# EAGLE design HomeAutomationModuleV2 (EAGLE 8.2.2)
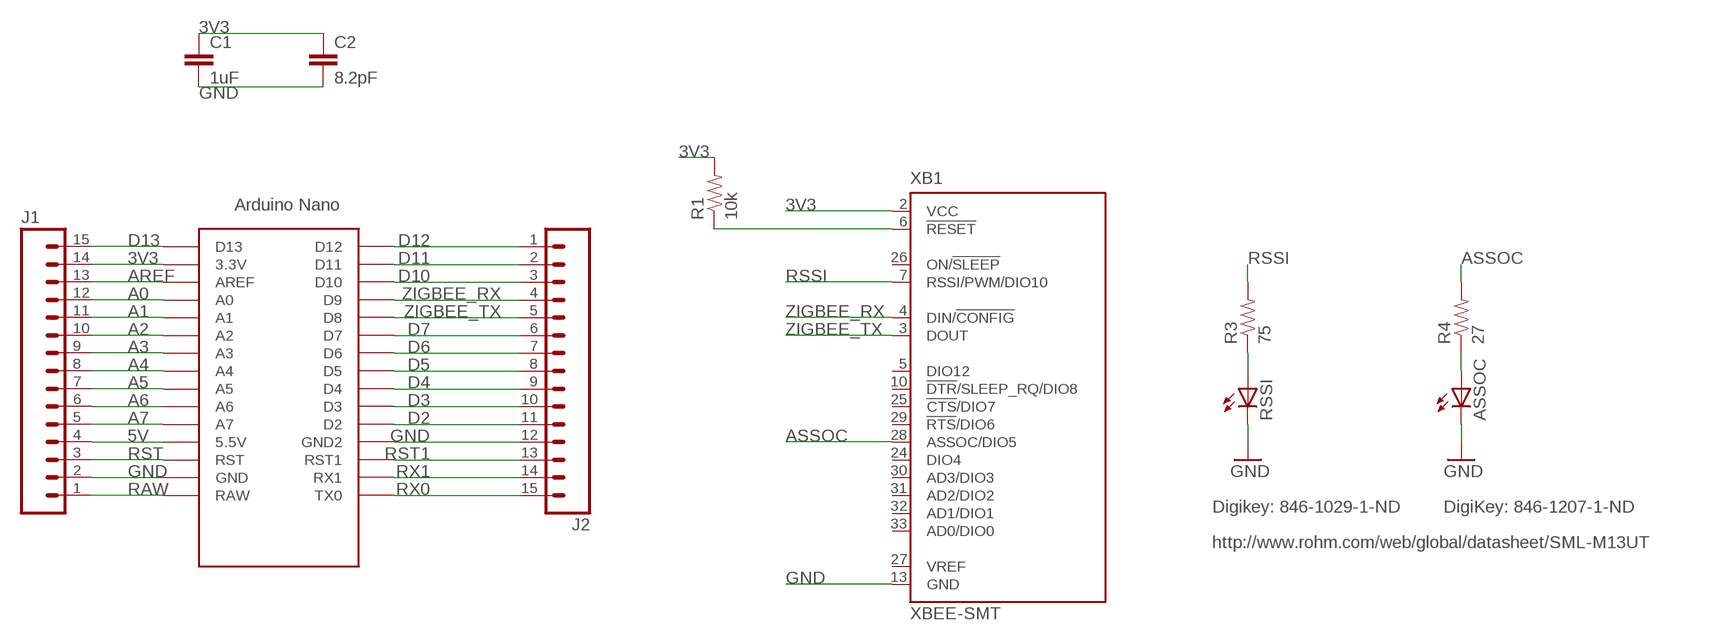
[diagram p0: schematic, sheet 1]

## Parts
ASSOC  LEDCHIP-LED0805  [CHIP-LED0805]
C1  1uF  0.33UF-50V-10%(0805)  [0805-CAP]
C2  8.2pF  0.33UF-50V-10%(0805)  [0805-CAP]
J1  M15  [1X15]
J2  M15  [1X15]
R1  10k  0.3OHM-1/8W-1%(0805)  [0805]
R3  75  RESISTOR0805-RES  [0805]
R4  27  RESISTOR0805-RES  [0805]
RSSI  LEDCHIP-LED0805  [CHIP-LED0805]
U$1  NANO  [NANO]
XB1  XBEE-SMT  [XBEE-SMT]

## Nets
3V3: C1.1 C2.1 J1.14 R1.2 U$1.3.3V XB1.2(VCC)
5V: J1.4 U$1.5V(5.5V)
A0: J1.12 U$1.A0
A1: J1.11 U$1.A1
A2: J1.10 U$1.A2
A3: J1.9 U$1.A3
A4: J1.8 U$1.A4
A5: J1.7 U$1.A5
A6: J1.6 U$1.A6
A7: J1.5 U$1.A7
AREF: J1.13 U$1.AREF
ASSOC: R4.2 XB1.28(ASSOC/DIO5)
D2: J2.11 U$1.D2
D3: J2.10 U$1.D3
D4: J2.9 U$1.D4
D5: J2.8 U$1.D5
D6: J2.7 U$1.D6
D7: J2.6 U$1.D7
D10: J2.3 U$1.D10
D11: J2.2 U$1.D11
D12: J2.1 U$1.D12
D13: J1.15 U$1.D13
GND: ASSOC.C C1.2 C2.2 J1.2 J2.12 RSSI.C U$1.GND U$1.GND1(GND2) XB1.13(GND)
N$1: ASSOC.A R4.1
N$2: R1.1 XB1.6(!RESET)
N$8: R3.1 RSSI.A
RAW: J1.1 U$1.RAW
RSSI: R3.2 XB1.7(RSSI/PWM/DIO10)
RST: J1.3 U$1.RST
RST1: J2.13 U$1.RST1
RX0: J2.15 U$1.TX0
RX1: J2.14 U$1.RX1
ZIGBEE_RX: J2.4 U$1.D9 XB1.4(DIN/!CONFIG)
ZIGBEE_TX: J2.5 U$1.D8 XB1.3(DOUT)
Unconnected: U$1.ICSP1 U$1.ICSP2 U$1.ICSP3 U$1.ICSP4 U$1.ICSP5 U$1.ICSP6 XB1.5(DIO12) XB1.10(!DTR!/SLEEP_RQ/DIO8) XB1.24(DIO4) XB1.25(!CTS!/DIO7) XB1.26(ON/!SLEEP) XB1.27(VREF) XB1.29(!RTS!/DIO6) XB1.30(AD3/DIO3) XB1.31(AD2/DIO2) XB1.32(AD1/DIO1) XB1.33(AD0/DIO0)

## Notes on the sheet
- Digikey: 846-1029-1-ND | DigiKey: 846-1207-1-ND
- http://www.rohm.com/web/global/datasheet/SML-M13UT

## Library data of the parts
ASSOC RSSI = adafruit:LED: LED OSRAM: - CHIPLED LG R971, LG N971, LY N971, LG Q971, LY Q971, LO R971, LY R971 LH N974, LH R974 LS Q976, LO Q976, LY Q976 LO Q996 - Hyper CHIPLED LW Q18S LB Q993, LB Q99A, LB R99A - SideLED LS A670, LO A670, LY A670, LG A670, LP A670 LB A673, LV A673, LT A673, LW A673 LH A674 LY A675 LS A676, LA A676, LO A676, LY A676, LW A676 LS A679, LY A679, LG A679 - Hyper Micro SIDELED® LS Y876, LA Y876, LO Y876, LY Y876 LT Y87S - SmartLED LW L88C, LW L88S LB L89C, LB L89S, LG L890 LS L89K, LO L89K, LY L89K LS L896, LA L896, LO L896, LY L896 - TOPLED LS T670, LO T670, LY T670, LG T670, LP T670 LSG T670, LSP T670, LSY T670, LOP T670, LYG T670 LG T671, LOG T671, LSG T671 LB T673, LV T673, LT T673, LW T673 LH T674 LS T676, LA T676, LO T676, LY T676, LB T676, LH T676, LSB T676, LW T676 LB T67C, LV T67C, LT T67C, LS T67K, LO T67K, LY T67K, LW E67C LS E67B, LA E67B, LO E67B, LY E67B, LB E67C, LV E67C, LT E67C LW T67C LS T679, LY T679, LG T679 LS T770, LO T770, LY T770, LG T770, LP T770 LB T773, LV T773, LT T773, LW T773 LH T774 LS E675, LA E675, LY E675, LS T675 LS T776, LA T776, LO T776, LY T776, LB T776 LHGB T686 LT T68C, LB T68C - Hyper Mini TOPLED® LB M676 - Mini TOPLED Santana® LG M470 LS M47K, LO M47K, LY M47K Source: http://www.osram.convergy.de/
C1 C2 = SparkFun-Capacitors:0.33UF-50V-10%(0805): CAP-08469; PROD_ID: CAP-08469; VALUE: 0.33uF
J1 J2 = SparkFun-Connectors:M15: Header 15 Standard 15-pin 0.1" header. Use with straight break away headers (SKU : PRT-00116), right angle break away headers (PRT-00553), swiss pins (PRT-00743), machine pins (PRT-00117), and female headers (PRT-00115).
R1 = SparkFun-Resistors:0.3OHM-1/8W-1%(0805): RES-11622; PROD_ID: RES-11622; VALUE: 0.3
R3 R4 = SparkFun-Passives:RESISTOR: Resistor Basic schematic elements and footprints for 0603, 1206, and PTH resistors.
U$1 = Arduino-clone:NANO: Arduino Nano
XB1 = xbee:XBEE-SMT: XBee(TM)/XBee-PRO(TM) ZB SMT RF Modules. Source: Digi (90002002_a.pdf) (http://www.digi.com/products/wireless-wired-embedded-solutions/zigbee-rf-modules/zigbee-mesh-module/xbee-smt.jsp#overview)

## Board
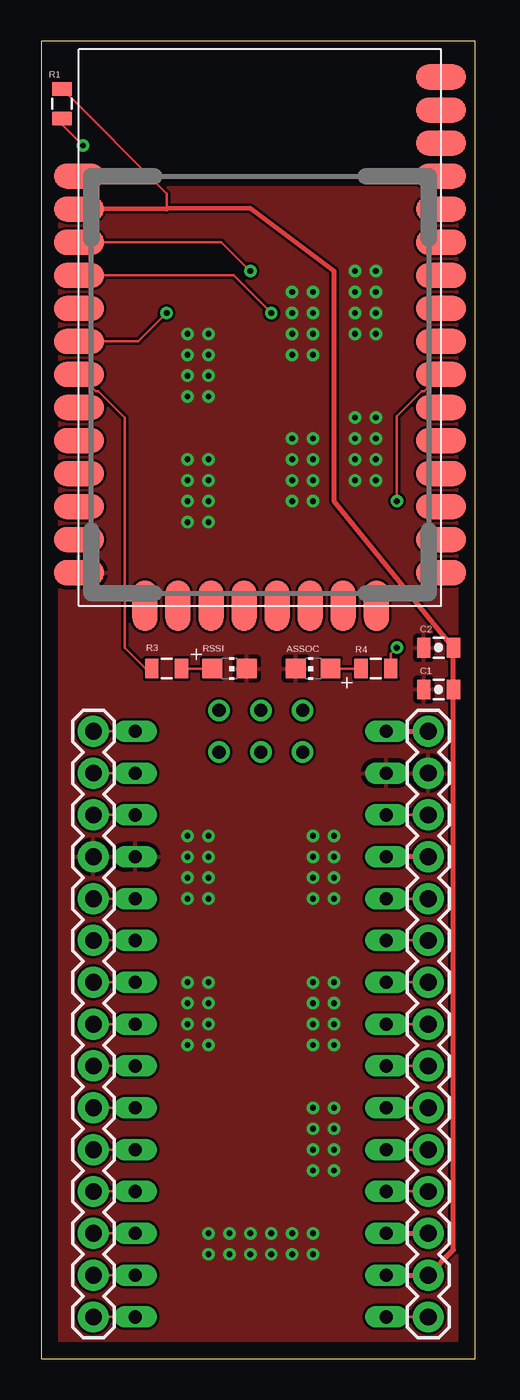
[diagram p1: board, top side]
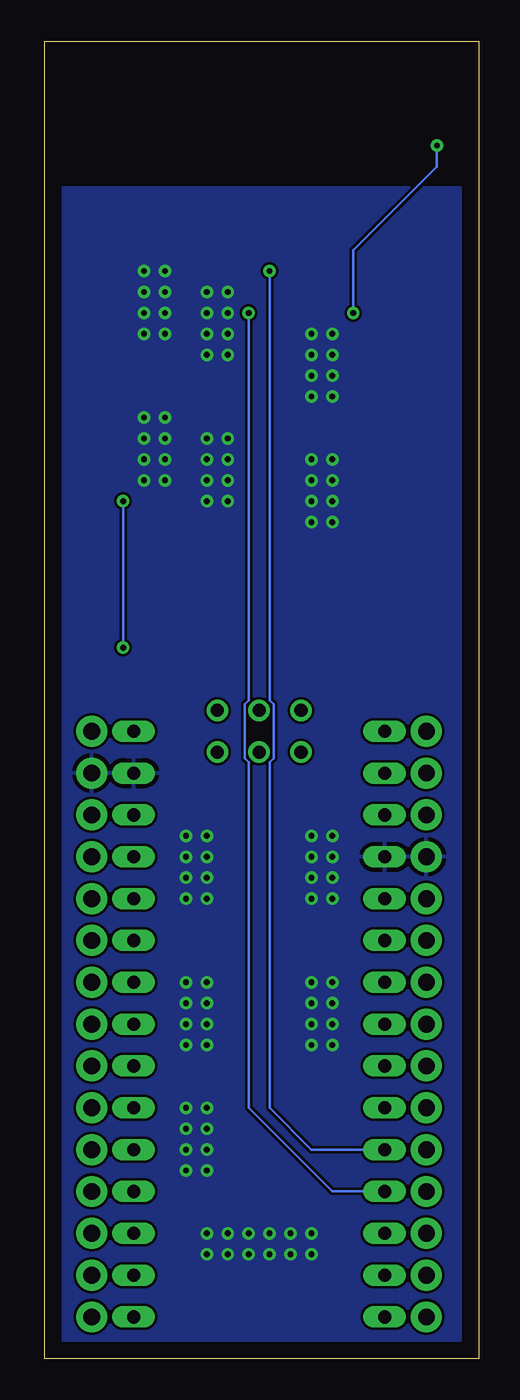
[diagram p2: board, bottom side, seen from below]

Size 26.34 x 80 mm. Coordinates in mm from the lower left corner, seen from the top.
Outline: 0,0 26.34,0 26.34,80 0,80 0,0
Copper layers (1*16): Top 0.035mm / dielectric 1.5mm / Bottom 0.035mm
Design rules "default": minimum track width 6mil, minimum drill 0.35mm, track to track 6mil, track to pad 6mil, pad to pad 6mil, via to via 6mil, smd to smd 6mil, copper to edge 40mil, drill to drill 6mil, minimum pad ring 10mil, minimum via ring 8mil, stop-mask expansion 4mil, vias tented up to drill 0mil, thermal gap 10mil

### Footprints (pad centres in the part's own frame; a part is rotated, then mirrored left to right if it is on the bottom)
CHIP-LED0805 = smd 1.2 x 1.2: A 0,-1.05; C 0,1.05
0805-CAP = smd 0.8 x 1.2: 1 -0.9,0; 2 0.9,0
1X15 = drill 1.016 pad 1.88: 1 0,0; 2 2.54,0; 3 5.08,0; 4 7.62,0; 5 10.16,0; 6 12.7,0; 7 15.24,0; 8 17.78,0; 9 20.32,0; 10 22.86,0; 11 25.4,0; 12 27.94,0; 13 30.48,0; 14 33.02,0; 15 35.56,0
0805 = smd 0.8 x 1.2: 1 -0.9,0; 2 0.9,0
NANO = drill 0.8 long: 3.3V -10.16,24.13; 5V -10.16,-1.27; A0 -10.16,19.05; A1 -10.16,16.51; A2 -10.16,13.97; A3 -10.16,11.43; A4 -10.16,8.89; A5 -10.16,6.35; A6 -10.16,3.81; A7 -10.16,1.27; AREF -10.16,21.59; D2 5.08,1.27; D3 5.08,3.81; D4 5.08,6.35; D5 5.08,8.89; D6 5.08,11.43; D7 5.08,13.97; D8 5.08,16.51; D9 5.08,19.05; D10 5.08,21.59; D11 5.08,24.13; D12 5.08,26.67; D13 -10.16,26.67; GND -10.16,-6.35; GND1 5.08,-1.27; RAW -10.16,-8.89; RST -10.16,-3.81; RST1 5.08,-3.81; RX1 5.08,-6.35; TX0 5.08,-8.89 | drill 0.8: ICSP1 -5.08,-10.16; ICSP2 -5.08,-7.62; ICSP3 -2.54,-10.16; ICSP4 -2.54,-7.62; ICSP5 0,-10.16; ICSP6 0,-7.62
XBEE-SMT = smd 3.048 x 1.524: 1 0,26.086; 2 0,24.079; 3 0,22.073; 4 0,20.066; 5 0,18.059; 6 0,16.053; 7 0,14.046; 8 0,12.04; 9 0,10.033; 10 0,8.026; 11 0,6.02; 12 0,4.013; 13 0,2.007; 22 21.996,2.007; 23 21.996,4.013; 24 21.996,6.02; 25 21.996,8.026; 26 21.996,10.033; 27 21.996,12.04; 28 21.996,14.046; 29 21.996,16.053; 30 21.996,18.059; 31 21.996,20.066; 32 21.996,22.073; 33 21.996,24.079; 34 21.996,26.086; 35 21.996,28.092; 36 21.996,30.099; 37 21.996,32.106 | smd 1.524 x 3.048: 14 4.013,0; 15 6.02,0; 16 8.026,0; 17 10.033,0; 18 12.04,0; 19 14.046,0; 20 16.053,0; 21 18.059,0

### Placement (x,y rotation side)
ASSOC  16.51,41.91 90 top
C1  24.13,40.64 180 top
C2  24.13,43.18 180 top
J1  23.5,38.1 270 top
J2  3.17,2.54 90 top
R1  1.27,76.2 90 top
R3  7.62,41.91 180 top
R4  20.32,41.91 0 top
RSSI  11.43,41.91 270 top
U$1  10.79,29.21 180 top
XB1  2.29,45.72 0 top

### Tracks (layer width: path | path; a pad name or v marks a point on that pad's centre or on a via)
3V3
  Top 0.152: 7.62,69.83 7.62,70.75 R1.2
  Top 0.305: XB1.2 7.62,69.83 12.7,69.85 17.78,66.04 17.78,52.07 C2.1 C1.1 25.03,6.62 J1.14 U$1.3.3V
5V
  Top 0.305: J1.4 U$1.5V
A0
  Top 0.152: J1.12 U$1.A0
A1
  Top 0.152: U$1.A1 J1.11
A2
  Top 0.152: U$1.A2 J1.10
A3
  Top 0.152: U$1.A3 J1.9
A4
  Top 0.152: J1.8 U$1.A4
A5
  Top 0.152: U$1.A5 J1.7
A6
  Top 0.152: J1.6 U$1.A6
A7
  Top 0.152: U$1.A7 J1.5
AREF
  Top 0.305: U$1.AREF J1.13
ASSOC  (via drill 0.35)
  Top 0.152: XB1.28 23.27,58.75 23.11,58.75 21.59,57.23 v21.59,52.07 | v21.59,43.18 21.22,42.81 R4.2
  Bottom 0.152: v21.59,52.07 v21.59,43.18
D2
  Top 0.152: J2.11 U$1.D2
D3
  Top 0.152: J2.10 U$1.D3
D4
  Top 0.152: J2.9 U$1.D4
D5
  Top 0.152: J2.8 U$1.D5
D6
  Top 0.152: J2.7 U$1.D6
D7
  Top 0.152: J2.6 U$1.D7
D10
  Top 0.152: J2.3 U$1.D10
D11
  Top 0.152: J2.2 U$1.D11
D12
  Top 0.152: J2.1 U$1.D12
D13
  Top 0.152: U$1.D13 J1.15
GND  (via drill 0.35)
  other vias: 10.16,7.62 11.43,7.62 12.7,7.62 13.97,7.62 15.24,7.62 16.51,7.62 10.16,6.35 11.43,6.35 12.7,6.35 13.97,6.35 15.24,6.35 16.51,6.35 8.89,54.61 10.16,54.61 8.89,53.34 10.16,53.34 8.89,52.07 10.16,52.07 8.89,50.8 10.16,50.8 19.05,66.04 20.32,66.04 19.05,64.77 20.32,64.77 19.05,63.5 20.32,63.5 19.05,62.23 20.32,62.23 15.24,55.88 16.51,55.88 15.24,54.61 16.51,54.61 15.24,53.34 16.51,53.34 15.24,52.07 16.51,52.07 8.89,62.23 10.16,62.23 8.89,60.96 10.16,60.96 8.89,59.69 10.16,59.69 8.89,58.42 10.16,58.42 16.51,22.86 17.78,22.86 16.51,21.59 17.78,21.59 16.51,20.32 17.78,20.32 16.51,19.05 17.78,19.05 16.51,31.75 17.78,31.75 16.51,30.48 17.78,30.48 16.51,29.21 17.78,29.21 16.51,27.94 17.78,27.94 16.51,15.24 17.78,15.24 16.51,13.97 17.78,13.97 16.51,12.7 17.78,12.7 16.51,11.43 17.78,11.43 8.89,31.75 10.16,31.75 8.89,30.48 10.16,30.48 8.89,29.21 10.16,29.21 8.89,27.94 10.16,27.94 8.89,22.86 10.16,22.86 8.89,21.59 10.16,21.59 8.89,20.32 10.16,20.32 8.89,19.05 10.16,19.05 19.05,57.15 20.32,57.15 19.05,55.88 20.32,55.88 19.05,54.61 20.32,54.61 19.05,53.34 20.32,53.34 15.24,64.77 16.51,64.77 15.24,63.5 16.51,63.5 15.24,62.23 16.51,62.23 15.24,60.96 16.51,60.96
  pour Top: 0,71.12 26.67,71.12 26.67,0 0,0
  pour Bottom: 0,71.12 26.67,71.12 26.67,0 0,0
N$1
  Top 0.152: ASSOC.A R4.1
N$2  (via drill 0.35)
  Top 0.152: R1.1 1.27,74.93 v2.54,73.66 | v7.62,63.5 5.89,61.77 XB1.6
  Bottom 0.152: v2.54,73.66 2.54,72.39 7.62,67.31 v7.62,63.5
N$8
  Top 0.152: R3.1 RSSI.A
RAW
  Top 0.305: U$1.RAW J1.1
RSSI
  Top 0.152: XB1.7 3.3,58.75 3.46,58.75 5.08,57.13 5.08,43.18 6.35,41.91 R3.2
RST
  Top 0.152: U$1.RST J1.3
RST1
  Top 0.152: J2.13 U$1.RST1
RX0
  Top 0.152: J2.15 U$1.TX0
RX1
  Top 0.152: J2.14 U$1.RX1
ZIGBEE_RX  (via drill 0.35)
  Top 0.152: v13.97,63.5 11.68,65.79 XB1.4 | J2.4 U$1.D9
  Bottom 0.152: U$1.D9 8.89,10.16 13.97,15.24 13.97,36.22 14.22,36.46 14.22,39.74 13.97,39.98 v13.97,63.5
ZIGBEE_TX  (via drill 0.35)
  Top 0.152: 2.77,67.31 XB1.3 10.95,67.79 v12.7,66.04 | J2.5 U$1.D8
  Bottom 0.152: U$1.D8 10.16,12.7 12.7,15.24 12.7,36.22 12.45,36.46 12.45,39.74 12.7,39.98 v12.7,66.04